# Altium schematic sheet shem lab pid and timer.SchDoc
size A
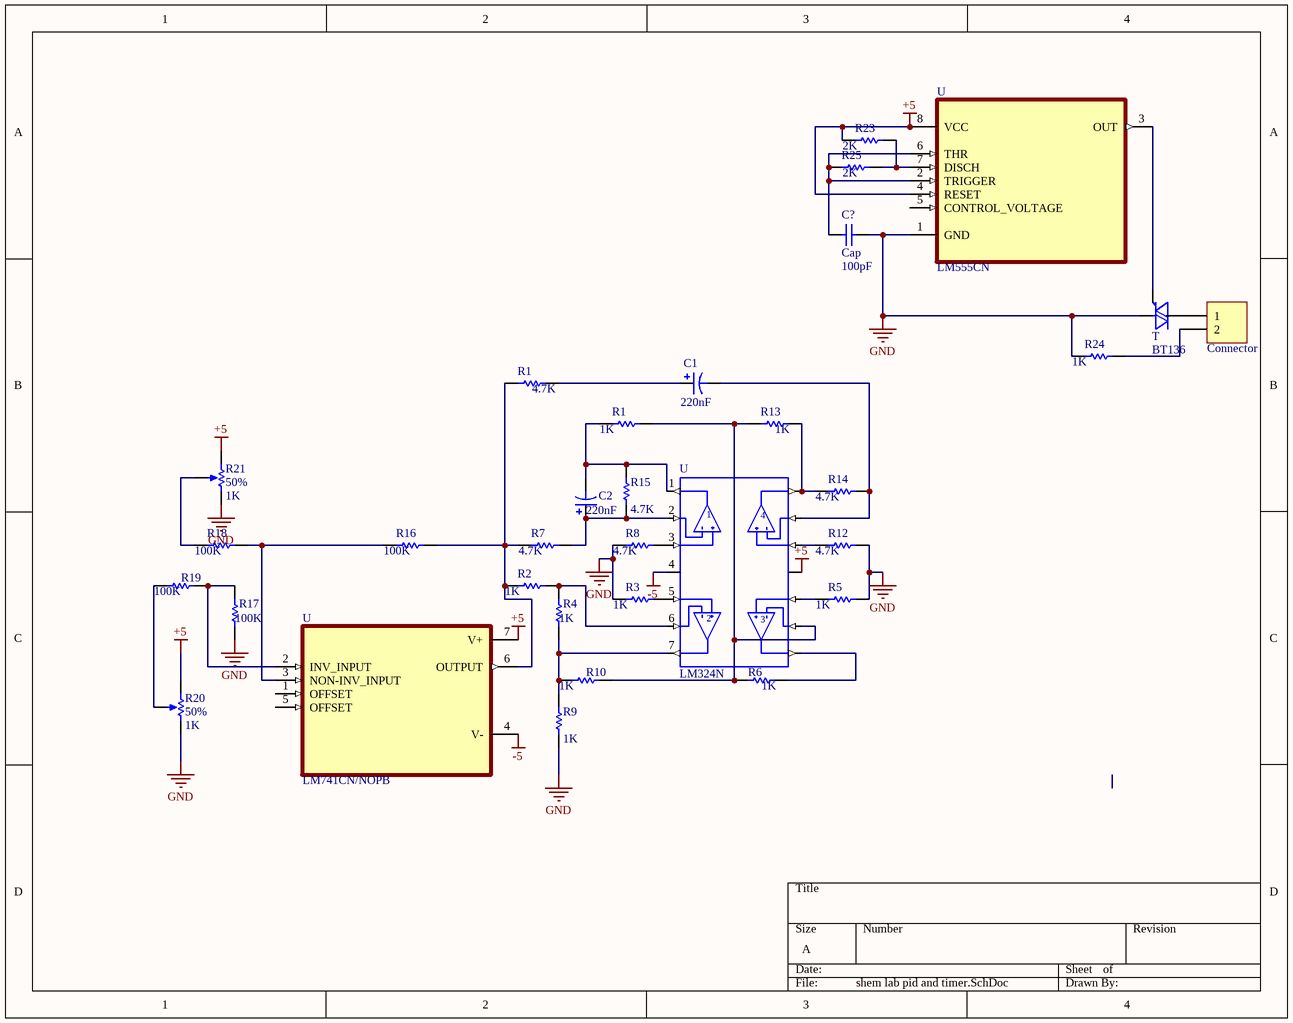
[diagram p0: shem lab pid and timer.SchDoc]

## Parts
(Parts that share a designator on the sheet are numbered #1, #2 ... from top to bottom, then left to right.)
?  Connector  [HDR1X2]
C1  value 220nF  [RB7.6-15]
C2  value 220nF  [RB7.6-15]
C?  Cap  value 100pF  [RAD-0.3]
R1#1  value 4.7K  [AXIAL-0.3]
R1#2  value 1K  [AXIAL-0.3]
R2  value 1K  [AXIAL-0.3]
R3  value 1K  [AXIAL-0.3]
R4  value 1K  [AXIAL-0.3]
R5  value 1K  [AXIAL-0.3]
R6  value 1K  [AXIAL-0.3]
R7  value 4.7K  [AXIAL-0.3]
R8  value 4.7K  [AXIAL-0.3]
R9  value 1K  [AXIAL-0.3]
R10  value 1K  [AXIAL-0.3]
R12  value 4.7K  [AXIAL-0.3]
R13  value 1K  [AXIAL-0.3]
R14  value 4.7K  [AXIAL-0.3]
R15  value 4.7K  [AXIAL-0.3]
R16  value 100K  [AXIAL-0.3]
R17  value 100K  [AXIAL-0.3]
R18  value 100K  [AXIAL-0.3]
R19  value 100K  [AXIAL-0.3]
R20  50%  value 1K  [VR5]
R21  50%  value 1K  [VR5]
R23  value 2K  [AXIAL-0.3]
R24  value 1K  [AXIAL-0.3]
R25  value 2K  [AXIAL-0.3]
T  BT136  [TO220AB]
U#1  LM555CN  [DIP254P762X533-8]
U#2  LM324N  [DIP762W45P254L1969H508Q14]
U#3  LM741CN/NOPB  [DIP794W45P254L959H508Q8]

## Nets
+5: R20.1(TOP) R21.1(TOP) R23.1 U#1.4(RESET) U#1.8(VCC) U#2.11(GND) U#3.7(V+)
-5: U#2.4(VCC) U#3.4(V-)
GND: C?.2 R3.1 R5.2 R8.1 R9.1 R12.2 R17.1 R20.2(BOT) R21.2(BOT) R24.1 T.1(A1) U#1.1(GND)
Net?_1: ?.1 T.2(A2)
Net?_2: ?.2 R24.2
NetC1_1: C1.1 R1#1.2
NetC1_2: C1.2 R14.2 U#2.13(4IN-)
NetC2_1: C2.1 R7.2 R15.1 U#2.2(1IN-)
NetC2_2: C2.2 R1#2.1 R15.2 U#2.1(1OUT)
NetC?_1: C?.1 R25.1 U#1.2(TRIGGER) U#1.6(THR)
NetR1#1_1: R1#1.1 R2.1 R7.1 R16.2 U#3.6(OUTPUT)
NetR1#2_2: R1#2.2 R6.1 R10.2 R13.1 U#2.9(3IN-)
NetR2_2: R2.2 R4.2 U#2.6(2IN-)
NetR3_2: R3.2 U#2.5(2IN+)
NetR4_1: R4.1 R9.2 R10.1 U#2.7(2OUT)
NetR5_1: R5.1 U#2.10(3IN+)
NetR6_2: R6.2 U#2.8(3OUT)
NetR8_2: R8.2 U#2.3(1IN+)
NetR12_1: R12.1 U#2.12(4IN+)
NetR13_2: R13.2 R14.1 U#2.14(4OUT)
NetR16_1: R16.1 R18.2 U#3.3(NON-INV_INPUT)
NetR17_2: R17.2 R19.2 U#3.2(INV_INPUT)
NetR18_1: R18.1 R21.3(TAP)
NetR19_1: R19.1 R20.3(TAP)
NetR23_2: R23.2 R25.2 U#1.7(DISCH)
NetT_3: T.3(G) U#1.3(OUT)

Not connected (* = marked no-connect by the designer): U#1 5(CONTROL_VOLTAGE); U#3 1(OFFSET) 5(OFFSET)

## Library data of the parts
? = Header 2: Header, 2-Pin; LatestRevisionDate: 17-Jul-2002; LatestRevisionNote: Re-released for DXP Platform.; Publisher: Altium Limited
C1 C2 = Cap Pol1: Polarized Capacitor (Radial); Published: 8-Jun-2000; LatestRevisionDate: 17-Jul-2002; LatestRevisionNote: Re-released for DXP Platform.; PackageReference: RB7.6-15; Publisher: Altium Limited; PackageDescription: Polarized Capacitor (Radial); 2 Leads
C? = Cap: Capacitor; Published: 8-Jun-2000; LatestRevisionDate: 17-Jul-2002; LatestRevisionNote: Re-released for DXP Platform.; PackageReference: RAD-0.3; Publisher: Altium Limited; PackageDescription: Radial Cap, Thru-Hole; 2 Leads; 0.3 in Pin Spacing
R1#1 R1#2 R2-R10 R12-R19 R23-R25 = Res1: Resistor; Published: 8-Jun-2000; LatestRevisionDate: 17-Jul-2002; LatestRevisionNote: Re-released for DXP Platform.; PackageReference: AXIAL-0.3; Publisher: Altium Limited; PackageDescription: Axial Device, Thru-Hole; 2 Leads; 0.3 in Pin Spacing
R20 R21 = RPot: Potentiometer; Sim Note: Enter the Resistance value and the set point into parameter fields.; Set Position: 0.5; Published: 8-Jun-2000; LatestRevisionDate: 17-Jul-2002; LatestRevisionNote: Re-released for DXP Platform.; PackageReference: VR5; Publisher: Altium Limited; PackageDescription: Variable Resistor, Thru-Hole; 3 Leads
T = BT136: TRIAC Standard 600V 4A Through Hole TO-220F; MF: WeEn Semiconductors; Price: None; Package: TO-252-3 WeEn Semiconductors; Value: *; MP: BT136; Availability: Unavailable; SnapEDA_Link: https://www.snapeda.com/parts/BT136/WeEn%20Semiconductors/view-part/4219141/?ref=snap
U#1 = LM555CN: 555 Type, Timer/Oscillator _Single_ IC 100kHz 8-PDIP; MF: Texas Instruments; MP: LM555CN; Package: DIP-8 Intersil; Price: None; Availability: Unavailable; SnapEDA_Link: https://www.snapeda.com/parts/LM555CN/Texas%20Instruments/view-part/2617191/?ref=snap; Value: *
U#2 = LM324N: General Purpose Amplifier 4 Circuit 14-DIP; MF: Texas Instruments; Value: *; SnapEDA_Link: https://www.snapeda.com/parts/LM324N/Texas%20Instruments/view-part/295/?ref=snap; MP: LM324N; Availability: Unavailable; Price: None; Package: DIP-14 STMicroelectronics
U#3 = LM741CN/NOPB: Single 44V 1MHz operational amplifier 8-PDIP 0 to 70; MF: Texas Instruments; SnapEDA_Link: https://www.snapeda.com/parts/LM741CN/NOPB/Texas%20Instruments/view-part/74633/?ref=snap; Availability: Unavailable; MP: LM741CN/NOPB; DigiKey-Purchase-URL: https://snapeda.com/shop?store=DigiKey&id=74633; Price: None; Value: *; Texas_Instruments-Purchase-URL: https://snapeda.com/shop?store=Texas+Instruments&id=74633; Mouser-Purchase-URL: https://snapeda.com/shop?store=Mouser&id=74633; Package: PDIP-8 Texas Instruments